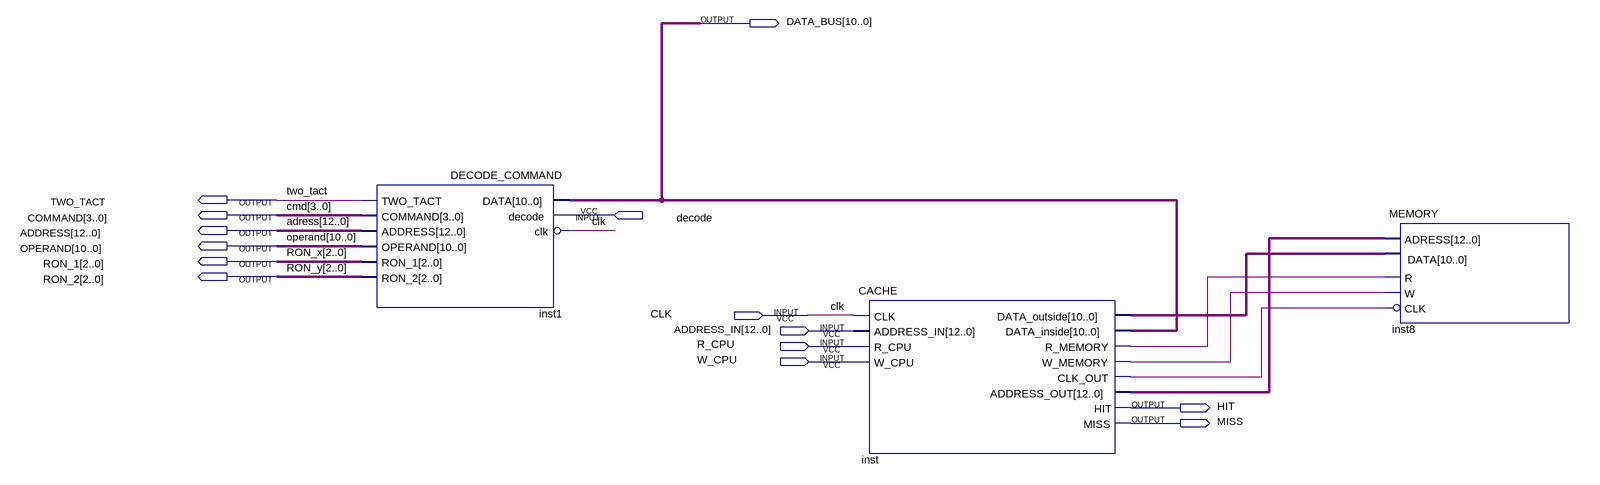
[diagram p0: schematic sheet]
// Quartus schematic CPU.bdf as structural Verilog: 3 symbols, 14 pins
module CPU (
  input  decode,
  input  CLK,
  input  [12:0] ADDRESS_IN,
  input  R_CPU,
  input  W_CPU,
  output [10:0] DATA_BUS,
  output TWO_TACT,
  output [3:0] COMMAND,
  output [12:0] ADDRESS,
  output [10:0] OPERAND,
  output [2:0] RON_1,
  output [2:0] RON_2,
  output HIT,
  output MISS
);

  wire inst_clk_out, inst_r_memory, inst_w_memory;
  wire [10:0] inst_data_outside;
  wire [12:0] inst_address_out;

  DECODE_COMMAND inst1 (
    .DATA(DATA_BUS), .decode(decode), .clk(~CLK), .TWO_TACT(TWO_TACT), .COMMAND(COMMAND), .ADDRESS(ADDRESS),
    .OPERAND(OPERAND), .RON_1(RON_1), .RON_2(RON_2));
  CACHE inst (
    .CLK(CLK), .ADDRESS_IN(ADDRESS_IN), .R_CPU(R_CPU), .W_CPU(W_CPU), .R_MEMORY(inst_r_memory),
    .W_MEMORY(inst_w_memory), .CLK_OUT(inst_clk_out), .ADDRESS_OUT(inst_address_out), .HIT(HIT), .MISS(MISS),
    .DATA_outside(inst_data_outside), .DATA_inside(DATA_BUS));
  MEMORY inst8 (
    .ADRESS(inst_address_out), .R(inst_r_memory), .W(inst_w_memory), .CLK(~inst_clk_out),
    .DATA(inst_data_outside));

  // Other names for the same wires on the sheet: adress[12:0] = ADDRESS; cmd[3:0] = COMMAND; RON_x[2:0] = RON_1;
  //   RON_y[2:0] = RON_2
endmodule
